# Altium schematic sheet MCU_Power.SchDoc
size A3
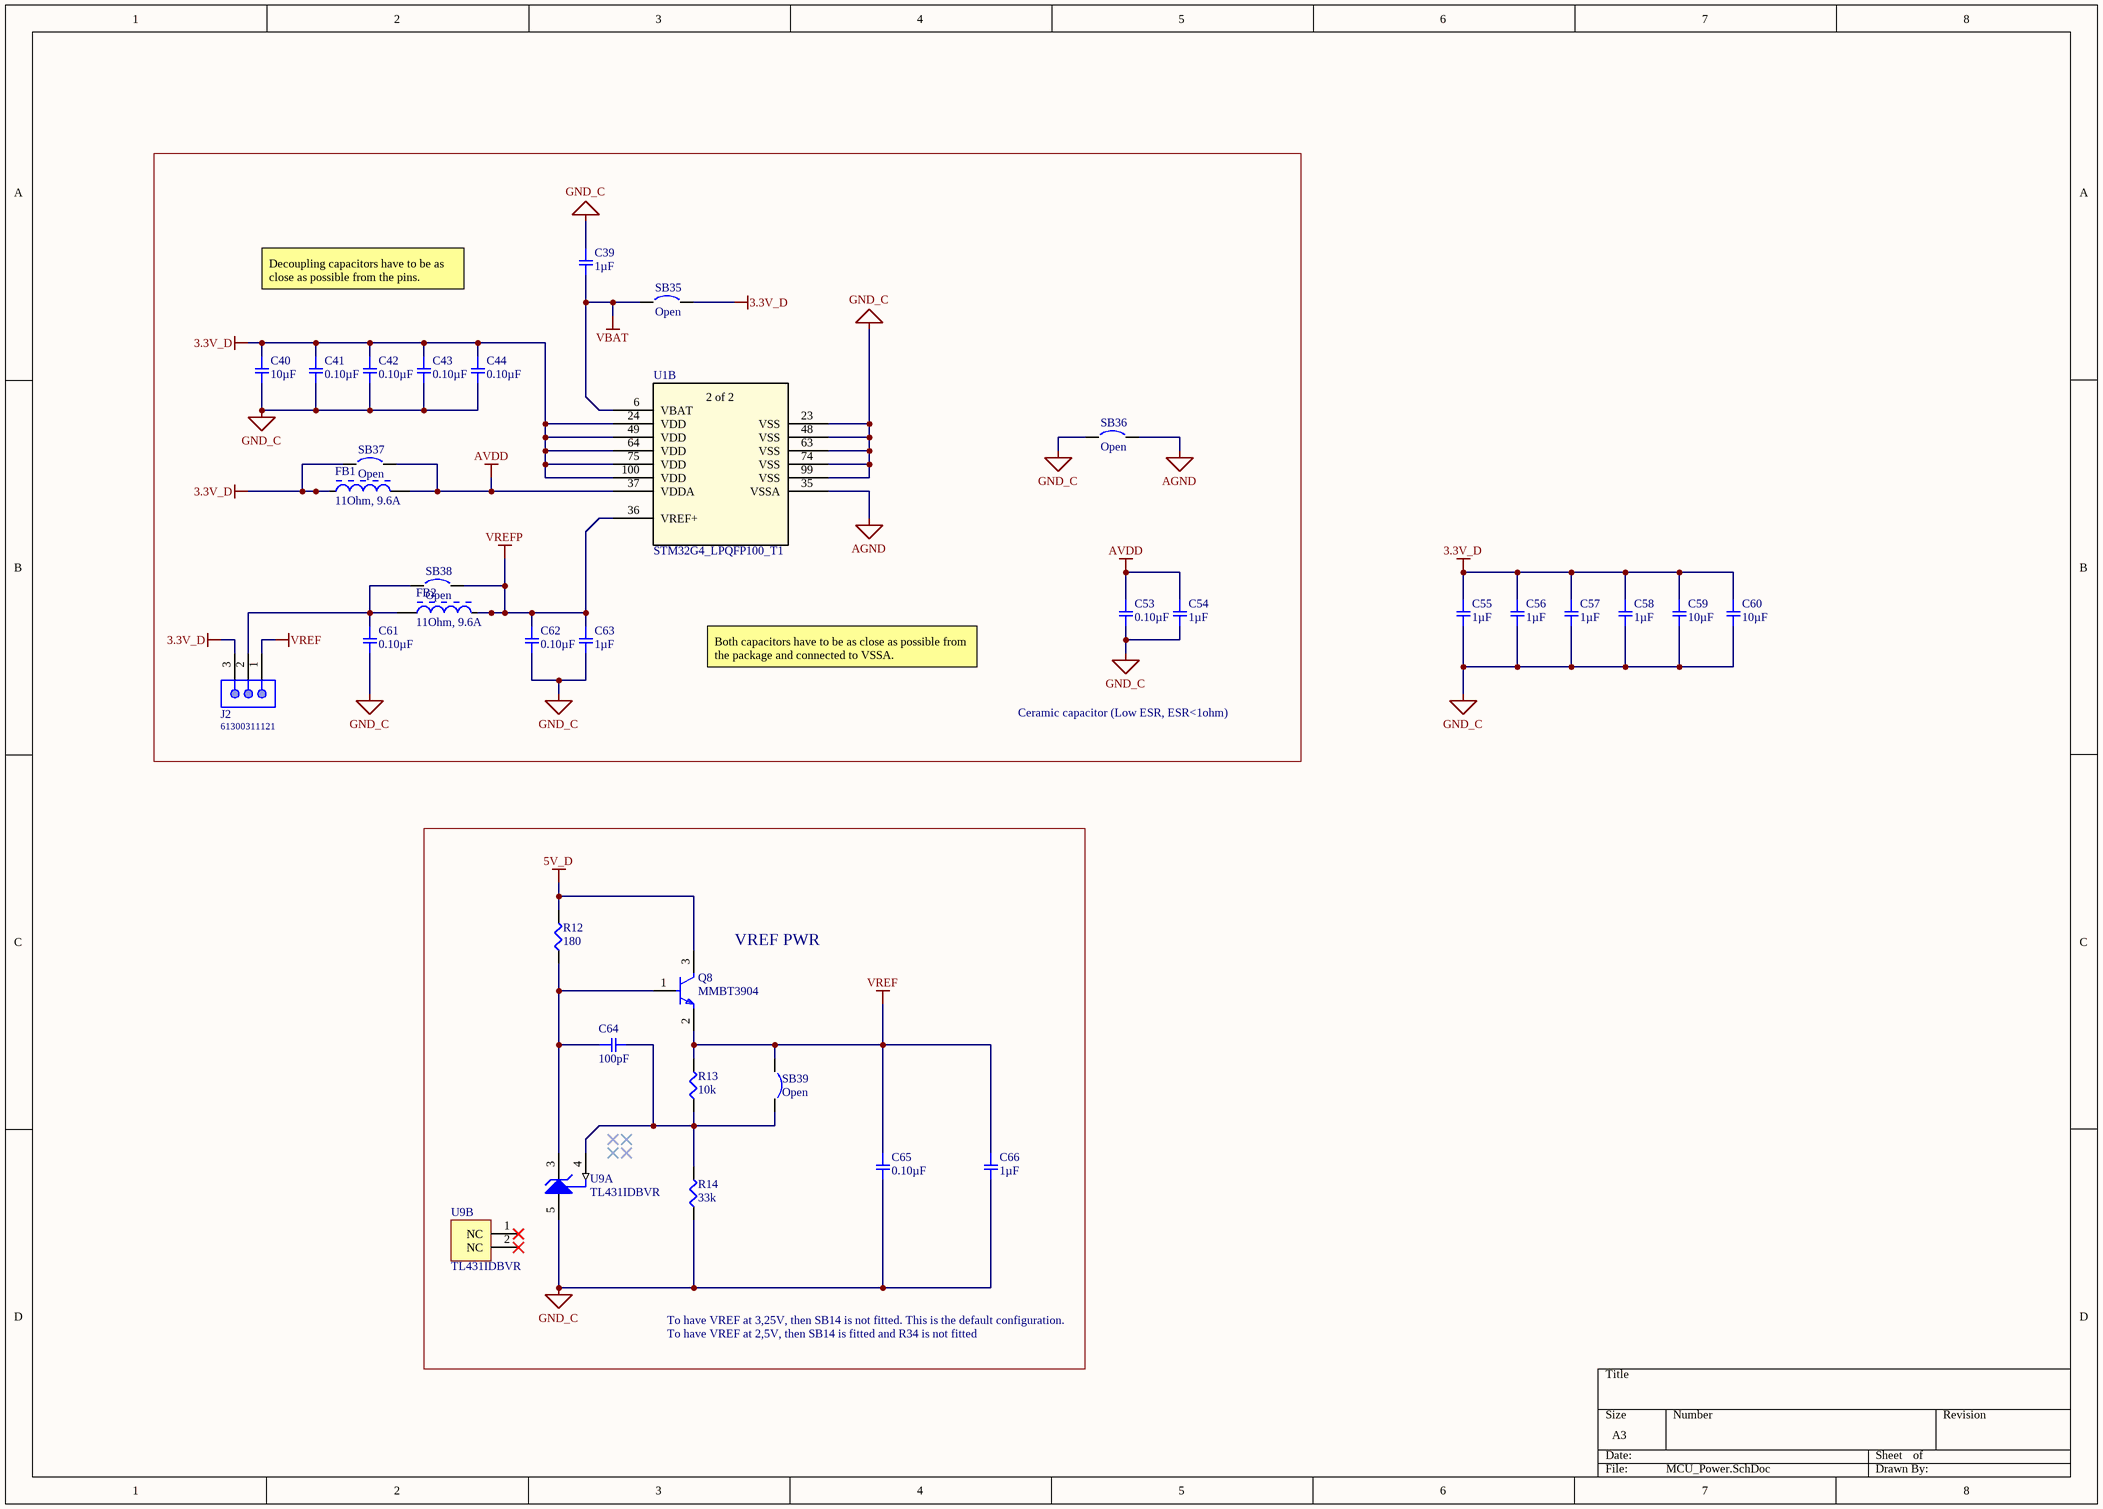
[diagram p0: MCU_Power.SchDoc]

## Parts
C39  1µF  [SMD-0805C]
C40  10µF  [SMD-0805C]
C41  0.10µF  [SMD-0805C]
C42  0.10µF  [SMD-0805C]
C43  0.10µF  [SMD-0805C]
C44  0.10µF  [SMD-0805C]
C53  0.10µF  [SMD-0805C]
C54  1µF  [SMD-0805C]
C55  1µF  [SMD-0805C]
C56  1µF  [SMD-0805C]
C57  1µF  [SMD-0805C]
C58  1µF  [SMD-0805C]
C59  10µF  [SMD-0805C]
C60  10µF  [SMD-0805C]
C61  0.10µF  [SMD-0805C]
C62  0.10µF  [SMD-0805C]
C63  1µF  [SMD-0805C]
C64  100pF  [SMD-0805C]
C65  0.10µF  [SMD-0805C]
C66  1µF  [SMD-0805C]
FB1  11Ohm, 9.6A  [WE-CBF_0805_High Speed]
FB2  11Ohm, 9.6A  [WE-CBF_0805_High Speed]
J2  61300311121  [61300311121]
Q8  MMBT3904  [FP-MA03D-MFG]
R12  180  [SMD-0603-RES]
R13  10k  [SMD-0603-RES]
R14  33k  [SMD-0603-RES]
SB35  Open  [SB_0603]  (no BOM)
SB36  Open  [SB_0603]  (no BOM)
SB37  Open  [SB_0603]  (no BOM)
SB38  Open  [SB_0603]  (no BOM)
SB39  Open  [SB_0603]  (no BOM)
U1  STM32G4_LPQFP100_T1  [TSQFP50P1600X1600X160-100N]  (part B of 2)
U9  TL431IDBVR  [DBV0005A_M]  (parts A,B of 2)

## Blocks framed on the sheet
Ceramic capacitor (Low ESR, ESR<1ohm): C39-C44 C53 C54 C61-C63 FB1 FB2 J2 SB35-SB38 U1
VREF PWR: C64-C66 Q8 R12-R14 SB39 U9

## Nets
3.3V_D: C40.1 C41.1 C42.1 C43.1 C44.1 C55.1 C56.1 C57.1 C58.1 C59.1 C60.1 FB1.1 J2.3 SB35.2 SB37.1 U1.24(VDD) U1.49(VDD) U1.64(VDD) U1.75(VDD) U1.100(VDD)
5V_D: Q8.3(C) R12.2
AGND: SB36.2 U1.35(VSSA)
AVDD: C53.1 C54.1 FB1.2 SB37.2 U1.37(VDDA)
GND_C: C39.1 C40.2 C41.2 C42.2 C43.2 C44.2 C53.2 C54.2 C55.2 C56.2 C57.2 C58.2 C59.2 C60.2 C61.2 C62.2 C63.2 C65.2 C66.2 R14.1 SB36.1 U1.23(VSS) U1.48(VSS) U1.63(VSS) U1.74(VSS) U1.99(VSS) U9.5(ANODE)
VBAT: C39.2 SB35.1 U1.6(VBAT)
VREF: C65.1 C66.1 J2.1 Q8.2(E) R13.2 SB39.1
VREFP: C62.1 C63.1 FB2.2 SB38.2 U1.36(VREF+)
NetC61_1: C61.1 FB2.1 J2.2 SB38.1
NetC64_1: C64.1 Q8.1(B) R12.1 U9.3(CATHODE)
NetC64_2: C64.2 R13.1 R14.2 SB39.2 U9.4(REF)

Not connected (* = marked no-connect by the designer): U9 1(NC)* 2(NC)*

## Notes on the sheet
- Decoupling capacitors have to be as close as possible from the pins.
- Both capacitors have to be as close as possible from the package and connected to VSSA.
- To have VREF at 3,25V, then SB14 is not fitted. This is the default configuration.
- To have VREF at 2,5V, then SB14 is fitted and R34 is not fitted
- (in symbol STM32G4_LPQFP100, part B) 2 of 2

## Library data of the parts
C39 C54-C58 C63 C66 = GCM219R71C105KA37D: CAP CER 1UF 16V X7R 0805; Manufacturer: Murata Electronics North America; Factory Stock: 0; Unit Price (USD): 0.17; Minimum Quantity: 1; Tolerance: ±10%; Datasheets: http://www.murata.com/~/media/webrenewal/support/library/catalog/products/capacitor/mlcc/c03e.ashx; Image: //media.digikey.com/photos/Murata%20Photos/NCP,GCM%20SERIES%200805.jpg; Digi-Key Part Number: 490-8043-1-ND; Part Number: GCM219R71C105KA37D; Quantity Available: 11770; @ qty: 0; Packaging: Cut Tape (CT); Series: GCM; Part Status: Active; Value: 1µF; Voltage: 16V; Temperature Coefficient: X7R; Operating Temperature: -55°C ~ 125°C; Features: -; Ratings: AEC-Q200; Applications: Automotive; Mounting Type: Surface Mount, MLCC; Package / Case: 0805 (2012 Metric); Size / Dimension: 0.079" L x 0.049" W (2.00mm x 1.25mm); Height - Seated (Max): -; Thickness (Max): 0.037" (0.95mm); Lead Spacing: -; Lead Style: -
C40 C59 C60 = GCM21BR71A106KE22L: CAP CER 10UF 10V X7R 0805; Manufacturer: Murata Electronics North America; Factory Stock: 0; Unit Price (USD): 0.49; Minimum Quantity: 1; Tolerance: ±10%; Datasheets: http://www.murata.com/~/media/webrenewal/support/library/catalog/products/capacitor/mlcc/c03e.ashx; Image: //media.digikey.com/photos/Murata%20Photos/NCP,GCM%20SERIES%200805.jpg; Digi-Key Part Number: 490-10674-1-ND; Part Number: GCM21BR71A106KE22L; Quantity Available: 125344; @ qty: 0; Packaging: Cut Tape (CT); Series: GCM; Part Status: Active; Value: 10µF; Voltage: 10V; Temperature Coefficient: X7R; Operating Temperature: -55°C ~ 125°C; Features: -; Ratings: AEC-Q200; Applications: Automotive; Mounting Type: Surface Mount, MLCC; Package / Case: 0805 (2012 Metric); Size / Dimension: 0.079" L x 0.049" W (2.00mm x 1.25mm); Height - Seated (Max): -; Thickness (Max): 0.055" (1.40mm); Lead Spacing: -; Lead Style: -
C41-C44 C53 C61 C62 C65 = GCJ21BR72A104KA01L: CAP CER 0.1UF 100V X7R 0805; Manufacturer: Murata Electronics North America; Factory Stock: 0; Unit Price (USD): 0.32; Minimum Quantity: 1; Tolerance: ±10%; Datasheets: http://www.murata.com/~/media/webrenewal/support/library/catalog/products/capacitor/mlcc/c03e.ashx; Image: //media.digikey.com/Renders/Murata%20Renders/0805%20(2012%20Metric)%20.85mm.jpg; Digi-Key Part Number: 490-5825-1-ND; Part Number: GCJ21BR72A104KA01L; Quantity Available: 1873; @ qty: 0; Packaging: Cut Tape (CT); Series: GCJ; Part Status: Active; Value: 0.10µF; Voltage: 100V; Temperature Coefficient: X7R; Operating Temperature: -55°C ~ 125°C; Features: Soft Termination; Ratings: AEC-Q200; Applications: Automotive, Boardflex Sensitive; Mounting Type: Surface Mount, MLCC; Package / Case: 0805 (2012 Metric); Size / Dimension: 0.079" L x 0.049" W (2.00mm x 1.25mm); Height - Seated (Max): -; Thickness (Max): 0.049" (1.25mm); Lead Spacing: -; Lead Style: -
C64 = GCM2165C2A101JA16J: CAP CER 100PF 100V NP0 0805; Manufacturer: Murata Electronics North America; Factory Stock: 0; Unit Price (USD): 0.17; Minimum Quantity: 1; Tolerance: ±5%; Temperature Coefficient: C0G, NP0; Datasheets: http://www.murata.com/~/media/webrenewal/support/library/catalog/products/capacitor/mlcc/c03e.ashx; Image: //media.digikey.com/Renders/Murata%20Renders/0805%28GxM6%29.jpg; Digi-Key Part Number: 490-8036-1-ND; Part Number: GCM2165C2A101JA16J; Quantity Available: 19299; @ qty: 0; Packaging: Cut Tape (CT); Series: GCM; Part Status: Active; Value: 100pF; Voltage: 100V; Operating Temperature: -55°C ~ 125°C; Features: -; Ratings: AEC-Q200; Applications: Automotive; Mounting Type: Surface Mount, MLCC; Package / Case: 0805 (2012 Metric); Size / Dimension: 0.079" L x 0.049" W (2.00mm x 1.25mm); Height - Seated (Max): -; Thickness (Max): 0.028" (0.70mm); Lead Spacing: -; Lead Style: -
FB1 FB2 = 7427920: WE-CBF SMT EMI Suppression Ferrite Bead, size 0805, 11Ohm, 9.6A; Manufacturer: Wurth Elektronik; Impedance max.: 24Ohm; DC Resistance max.: 0.15Ohm; Type: High Speed; ComponentLink1Description: Manufacturer; ComponentLink1URL: http://www.we-online.de; ComponentLink2Description: Datasheet; ComponentLink2URL: https://www.we-online.com/catalog/datasheet/7427920.pdf; Operating Temperature: -55 to +125degC; Packaging: Tape and Reel; Published Date: March 2020; Rated Current: 9.6A; Manufacturer Part Number: 7427920; Impedance @100MHz: 11Ohm; Mounting Technology: SMT; Size: 0805
J2 = 61300311121: WR-PHD Pin Header, THT, pitch 2.54mm, Single Row, Vertical, 3pin; Pin Number: 3; Gender: Male; Rated Current: 3A; Working Voltage: 250VAC; Withstanding Voltage: 500VAC; Contact Resistance: 20mOhm; ComponentLink1Description: Manufacturer; ComponentLink1URL: http://www.we-online.de; ComponentLink2Description: Datasheet; ComponentLink2URL: https://katalog.we-online.de/em/datasheet/6130xx11121.pdf; Part Number: 61300311121; Published Date: June 2019; Publisher: Wurth Elektronik; Pitch: 2.54mm; Operating Temperature: -40 to +105degC; Mounting Technology: THT; Packaging: Bag; Row Number: Single; Orientation: Vertical
Q8 = CMP-07170-000026-1: TRANS NPN 40V 0.2A SOT-23; Frequency: 300MHz; hFE Min: 100; Power Dissipation: 350mW; Element Configuration: Single; Collector Base Voltage (VCBO): 60V; Max Collector Current: 200mA; Number of Elements: 1; Emitter Base Voltage (VEBO): 6V; Collector Emitter Saturation Voltage: 300mV; REACH SVHC: No SVHC; Width: 0.25inch; Mount: Surface Mount; Height: 0.25inch; Case/Package: SOT-23; Radiation Hardening: No; Max Power Dissipation: 350mW; Gain Bandwidth Product: 300MHz; Max Frequency: 300MHz; Collector Emitter Voltage (VCEO): 40V; Max Operating Temperature: 150°C; Termination: SMD/SMT; Weight: 0.03g; Contact Plating: Tin; Package Quantity: 1; Current Rating: 200mA; Max Breakdown Voltage: 40V; Polarity: NPN; Min Operating Temperature: -55°C; Lead Free: Lead Free; Length: 0.25inch; Collector Emitter Breakdown Voltage: 40V; Packaging: Tape and Reel; Voltage Rating (DC): 40V; Number of Pins: 3; Transition Frequency: 300MHz
R12 = ERJ-3EKF1800V: RES SMD 180 OHM 1% 1/10W 0603; Manufacturer: Panasonic Electronic Components; Factory Stock: 0; Unit Price (USD): 0.00379; @ qty: 1500; Minimum Quantity: 1; Power (Watts): 0.1W, 1/10W; Temperature Coefficient: ±100ppm/°C; Part Number: ERJ-3EKF1800V; Datasheets: http://industrial.panasonic.com/www-cgi/jvcr13pz.cgi?E+PZ+3+AOA0002+ERJ3EKF1800V+7+WW; Image: //media.digikey.com/Photos/Panasonic%20Photos/MFG_ERJ-P6W%20Series.jpg; Digi-Key Part Number: P180HCT-ND; Quantity Available: 115705; Packaging: Cut Tape (CT); Series: ERJ; Part Status: Active; Value: 180; Tolerance: ±1%; Composition: Thick Film; Features: Automotive AEC-Q200; Operating Temperature: -55°C ~ 155°C; Package / Case: 0603 (1608 Metric); Supplier Device Package: 0603; Size / Dimension: 0.063" L x 0.031" W (1.60mm x 0.80mm); Height - Seated (Max): 0.022" (0.55mm); Number of Terminations: 2; Failure Rate: -
R13 = ERJ-3EKF1002V: RES SMD 10K OHM 1% 1/10W 0603; Manufacturer: Panasonic Electronic Components; Factory Stock: 0; Unit Price (USD): 0.00379; @ qty: 1500; Minimum Quantity: 1; Power (Watts): 0.1W, 1/10W; Temperature Coefficient: ±100ppm/°C; Part Number: ERJ-3EKF1002V; Datasheets: http://industrial.panasonic.com/www-cgi/jvcr13pz.cgi?E+PZ+3+AOA0002+ERJ3EKF1002V+7+WW; Image: //media.digikey.com/Photos/Panasonic%20Photos/MFG_ERJ-P6W%20Series.jpg; Digi-Key Part Number: P10.0KHCT-ND; Quantity Available: 6703141; Packaging: Cut Tape (CT); Series: ERJ; Part Status: Active; Value: 10k; Tolerance: ±1%; Composition: Thick Film; Features: Automotive AEC-Q200; Operating Temperature: -55°C ~ 155°C; Package / Case: 0603 (1608 Metric); Supplier Device Package: 0603; Size / Dimension: 0.063" L x 0.031" W (1.60mm x 0.80mm); Height - Seated (Max): 0.022" (0.55mm); Number of Terminations: 2; Failure Rate: -
R14 = ERJ-3EKF3302V: RES SMD 33K OHM 1% 1/10W 0603; Manufacturer: Panasonic Electronic Components; Factory Stock: 0; Unit Price (USD): 0.00379; @ qty: 1500; Minimum Quantity: 1; Power (Watts): 0.1W, 1/10W; Temperature Coefficient: ±100ppm/°C; Part Number: ERJ-3EKF3302V; Datasheets: http://industrial.panasonic.com/www-cgi/jvcr13pz.cgi?E+PZ+3+AOA0002+ERJ3EKF3302V+7+WW; Image: //media.digikey.com/Photos/Panasonic%20Photos/MFG_ERJ-P6W%20Series.jpg; Digi-Key Part Number: P33.0KHCT-ND; Quantity Available: 240194; Packaging: Cut Tape (CT); Series: ERJ; Part Status: Active; Value: 33k; Tolerance: ±1%; Composition: Thick Film; Features: Automotive AEC-Q200; Operating Temperature: -55°C ~ 155°C; Package / Case: 0603 (1608 Metric); Supplier Device Package: 0603; Size / Dimension: 0.063" L x 0.031" W (1.60mm x 0.80mm); Height - Seated (Max): 0.022" (0.55mm); Number of Terminations: 2; Failure Rate: -
SB35-SB39 = Solder Bridge: Circuit Breaker; Published: 24-Mar-1999; Revision: July-2002: Re-released for DXP Platform.; Publisher: Altium Limited
U1 = STM32G4_LPQFP100: No Description Available; Vendor: STMicroelectronics; Built_By: EMA_Jessica; Manufacturer_Part_Number: STM32G4_LPQFP100_T1; Copyright: Copyright (C) 2016 Accelerated Designs. All rights reserved; RefDes: RefDes; Type: DEV
U9 = CMP-0366-00644-2: Adjustable Precision Shunt Regulator, 34 ppm / degC, 100 mA, -40 to 85 degC, 5-pin SOT-23 (DBV), Green (RoHS & no Sb/Br); Manufacturer: Texas Instruments; Iout/Iz(Max)(mA): 100; Min Iz for Regulation(uA): 600; Temp Coeff(Typ)(ppm/ degree C): 34; SubFamily: Shunt Voltage Reference; Temp Coeff(Max)(ppm/ degree C): 92; VO Adj(Min)(V): 2.495; Rating: Military; VO Adj(Max)(V): 36; Initial Accuracy @ 25/deg C(%): 2; Eco-Plan: Green (RoHS & no Sb/Br); Mounting Technology: Surface Mount; Code_JEDEC: MO-178; DatasheetVersion: SLVS543M; ComponentLink3Description: Package Specification; PackageReference: DBV0005A; ComponentLink3URL: http://www.ti.com/litv/pdf/mpds018i; PackageVersion: 4073253-4/K; ComponentLink1URL: http://www.ti.com/; ComponentLink1Description: Manufacturer URL; ComponentLink2URL: http://www.ti.com/general/docs/lit/getliterature.tsp?genericPartNumber=TL431&fileType=pdf; ComponentLink2Description: Datasheet; PackageDescription: 5-Pin Plastic Small Outline, Body 1.60 Ã— 2.90 mm, Pitch 0.95 mm; PartNumber: TL431IDBVR